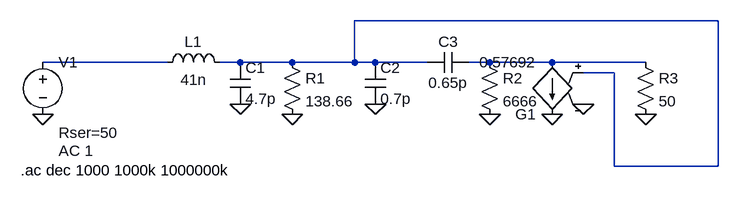
[diagram p0: schematic Small_signal_RF_transistor.asc]
Small_signal_RF_transistor.asc, the LTspice schematic file:
Version 4
SHEET 1 1044 680
WIRE 1040 80 480 80
WIRE 192 144 0 144
WIRE 304 144 272 144
WIRE 384 144 304 144
WIRE 480 144 480 80
WIRE 480 144 384 144
WIRE 512 144 480 144
WIRE 592 144 512 144
WIRE 688 144 656 144
WIRE 784 144 688 144
WIRE 928 144 784 144
WIRE 880 160 832 160
WIRE 880 304 880 160
WIRE 1040 304 1040 80
WIRE 1040 304 880 304
FLAG 0 224 0
FLAG 304 208 0
FLAG 384 224 0
FLAG 512 208 0
FLAG 832 208 0
FLAG 784 224 0
FLAG 688 224 0
FLAG 928 224 0
SYMBOL voltage 0 128 R0
WINDOW 3 24 152 Left 2
WINDOW 123 24 152 Left 2
WINDOW 39 24 124 Left 2
SYMATTR InstName V1
SYMATTR Value ""
SYMATTR Value2 AC 1
SYMATTR SpiceLine Rser=50
SYMBOL ind 176 160 R270
WINDOW 0 32 56 VTop 2
WINDOW 3 5 56 VBottom 2
SYMATTR InstName L1
SYMATTR Value 41n
SYMBOL cap 288 144 R0
SYMATTR InstName C1
SYMATTR Value 4.7p
SYMBOL res 368 128 R0
SYMATTR InstName R1
SYMATTR Value 138.66
SYMBOL cap 496 144 R0
SYMATTR InstName C2
SYMATTR Value 0.7p
SYMBOL g2 784 240 R180
SYMATTR InstName G1
SYMATTR Value 0.57692
SYMBOL res 672 128 R0
SYMATTR InstName R2
SYMATTR Value 6666
SYMBOL res 912 128 R0
SYMATTR InstName R3
SYMATTR Value 50
SYMBOL cap 656 128 R90
WINDOW 0 0 32 VBottom 2
WINDOW 3 32 32 VTop 2
SYMATTR InstName C3
SYMATTR Value 0.65p
TEXT -34 310 Left 2 !.ac dec 1000 1000k 1000000k

The netlist it stands for:
* Small_signal_RF_transistor.asc
V1 N002 0 AC 1 Rser=50
L1 N002 N001 41n
C1 N001 0 4.7p
R1 N001 0 138.66
C2 N001 0 0.7p
G1 N003 0 N001 0 0.57692
R2 N003 0 6666
R3 N003 0 50
C3 N003 N001 0.65p
.ac dec 1000 1000k 1000000k
.backanno
.end